# Altium schematic sheet TopSheet.SchDoc
size A4; CompanyName: Technische Hochschule Nürnberg Georg Simon Ohm; Organization: UltraZohm; Address1: Kesslerplatz 12; Address2: 90489 Nürnberg; Address3: GERMANY; Website: www.ultrazohm.com
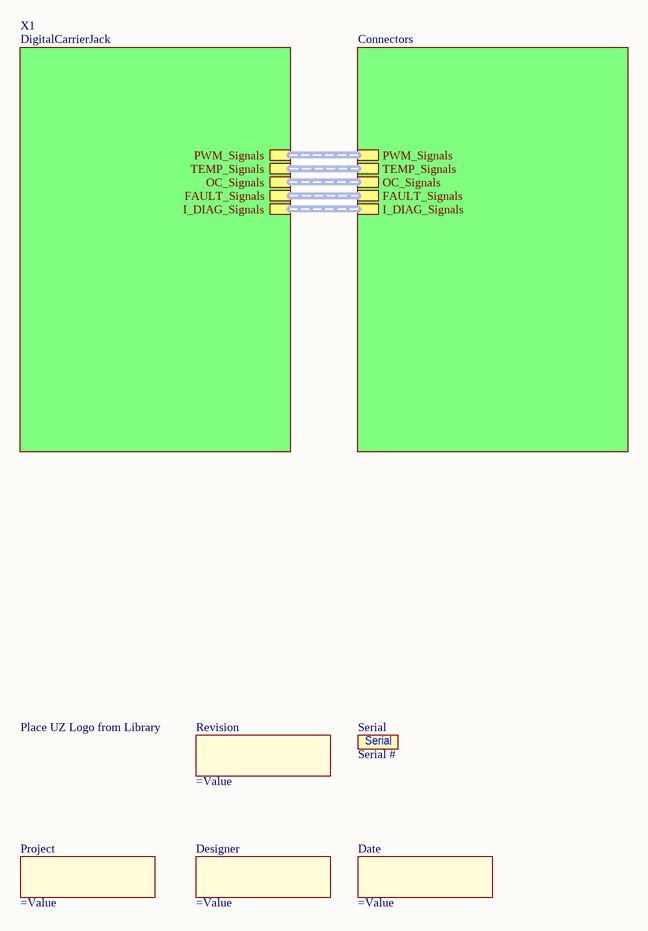
[diagram p0: TopSheet.SchDoc]

## Parts
Date  (no value)  [Comment]  (no BOM)
Designer  (no value)  [Designator:comment]  (no BOM)
Project  (no value)  [Designator:comment]  (no BOM)
Revision  (no value)  [Designator:comment]  (no BOM)
Serial  Serial #  [SERIAL]  (no BOM)

## Sub-sheets
X1 = DigitalCarrierJack: PWM_Signals (harness DigCon_DIG_IO), TEMP_Signals (harness DigCon_PowerSupply), OC_Signals (harness DigCon_PowerSupply), FAULT_Signals (harness DigCon_PowerSupply), I_DIAG_Signals (harness DigCon_PowerSupply)
? = Connectors: PWM_Signals (harness DigCon_DIG_IO), TEMP_Signals (harness DigCon_PowerSupply), OC_Signals (harness DigCon_PowerSupply), FAULT_Signals (harness DigCon_PowerSupply), I_DIAG_Signals (harness DigCon_PowerSupply)

## Buses and harness runs
harness sheet /FAULT_Signals = sheet X1/FAULT_Signals
harness sheet /I_DIAG_Signals = sheet X1/I_DIAG_Signals
harness sheet /OC_Signals = sheet X1/OC_Signals
harness sheet /PWM_Signals = sheet X1/PWM_Signals
harness sheet /TEMP_Signals = sheet X1/TEMP_Signals

## Notes on the sheet
- (near Revision) Place UZ Logo from Library
- Title
- Revision:
- Design Engineer:
- Date:
- Project:
- Sheet
- of

## Library data of the parts
Date = ProjectDate: Year and month of the design finish; Value: =FinDate; Created: 2020-01-08_Thilo_Wendt
Designer = ProjectAuthor: Value: =AuthorParam; Created: 2020-01-08_Thilo_Wendt
Project = ProjectName: Value: =ProjectNameCustom; Created: 2020-01-08_Thilo_Wendt
Revision = ProjectRevision: Value: =ProjectRevision; Created: 2020-01-08_Thilo_Wendt
Serial = SerialNumber: Empty serial number of the PCB. Can be used for manually writing the serial number